# Altium schematic sheet filtro2.SchDoc
size Letter
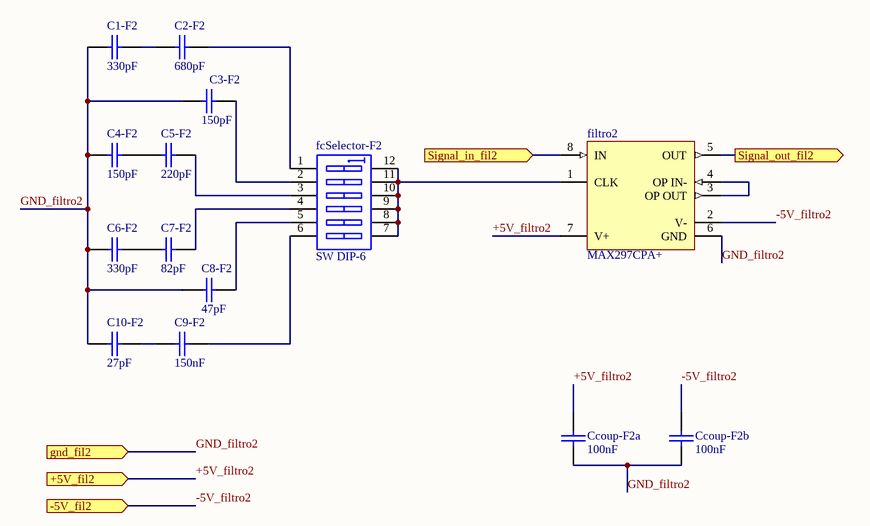
[diagram p0: filtro2.SchDoc]

## Parts
C1-F2  330pF  [CAP200]
C2-F2  680pF  [CAP200]
C3-F2  150pF  [CAP200]
C4-F2  150pF  [CAP200]
C5-F2  220pF  [CAP200]
C6-F2  330pF  [CAP200]
C7-F2  82pF  [CAP200]
C8-F2  47pF  [CAP200]
C9-F2  150nF  [CAP200]
C10-F2  27pF  [CAP200]
Ccoup-F2a  100nF  [CAP200]
Ccoup-F2b  100nF  [CAP200]
fcSelector-F2  SW DIP-6  [DIP-12/SW]
filtro2  MAX297CPA+  [MAXM-P8+2]

## Ports
+5V_fil2 (in), -5V_fil2 (in), gnd_fil2 (in), Signal_in_fil2 (in), Signal_out_fil2 (out)

## Nets
+5V_filtro2: Ccoup-F2a.2 filtro2.7(V+) ; port +5V_fil2
-5V_filtro2: Ccoup-F2b.2 filtro2.2(V-) ; port -5V_fil2
GND_filtro2: C1-F2.1 C3-F2.1 C4-F2.1 C6-F2.1 C8-F2.1 C10-F2.1 Ccoup-F2a.1 Ccoup-F2b.1 filtro2.6(GND) ; port gnd_fil2
Signal_in_fil2: filtro2.8(IN) ; port Signal_in_fil2
Signal_out_fil2: filtro2.5(OUT) ; port Signal_out_fil2
NetC1-F2_2: C1-F2.2 C2-F2.1
NetC2-F2_2: C2-F2.2 fcSelector-F2.1(A1)
NetC3-F2_2: C3-F2.2 fcSelector-F2.2(A2)
NetC4-F2_2: C4-F2.2 C5-F2.1
NetC5-F2_2: C5-F2.2 fcSelector-F2.3(A3)
NetC6-F2_2: C6-F2.2 C7-F2.1
NetC7-F2_2: C7-F2.2 fcSelector-F2.4(A4)
NetC8-F2_2: C8-F2.2 fcSelector-F2.5(A5)
NetC9-F2_1: C9-F2.1 C10-F2.2
NetC9-F2_2: C9-F2.2 fcSelector-F2.6(A6)
NetfcSelector-F2_7: fcSelector-F2.7(B6) fcSelector-F2.8(B5) fcSelector-F2.9(B4) fcSelector-F2.10(B3) fcSelector-F2.11(B2) fcSelector-F2.12(B1) filtro2.1(CLK)
Netfiltro2_3: filtro2.3(OP_OUT) filtro2.4(OP_IN-)

## Library data of the parts
C1-F2 C2-F2 C3-F2 C4-F2 C5-F2 C6-F2 C7-F2 C8-F2 C9-F2 C10-F2 Ccoup-F2a Ccoup-F2b = CAP
fcSelector-F2 = SW DIP-6: DIP Switch, 6 Position, SPST; Published: 24-Mar-1999; LatestRevisionDate: 17-Jul-2002; LatestRevisionNote: Re-released for DXP Platform.; PackageReference: DIP-12/SW; Publisher: Altium Limited; PackageDescription: DIP Switch; 12 Leads
filtro2 = MAX297CPA+: 8th-Order Switched Capacitor Lowpass Filter, Elliptic, 1.5 Transition Ratio, 0 to 70 degC, 8-Pin DIP (P8+2), Pb-Free; Generic Part Number: MAX297; Filter Sections: 1; Order Per Filter Section: 8; Program Method: Clock; DatasheetVersion: Rev. 2; PackageVersion: Rev. E, 04/2011; PackageReference: P8+2; PackageDescription: 8-Pin Plastic Dual-In-Line, Narrow (0.3in) (P8+2), Body 9.375 x 6.985 mm, Pitch 2.54 mm; Supplier 1: Digi-Key; Supplier Part Number 1: MAX297CPA+-ND; Supplier 2: Mouser; Supplier Part Number 2: 700-MAX297CPA; Filter Characteristic: Elliptic; Filter Class: Switched Cap; Filter Type: Lowpass; RoHS: Pb-Free; Mounting Technology: Through Hole; Code_JEDEC: MS001-XX; PartNumber: MAX297CPA+; ComponentLink1Description: Manufacturer URL; ComponentLink1URL: http://www.maximintegrated.com/; ComponentLink2Description: Datasheet; ComponentLink2URL: http://datasheets.maximintegrated.com/en/ds/MAX293-MAX297.pdf; ComponentLink3Description: Package Specification; ComponentLink3URL: http://pdfserv.maximintegrated.com/package_dwgs/21-0043.PDF